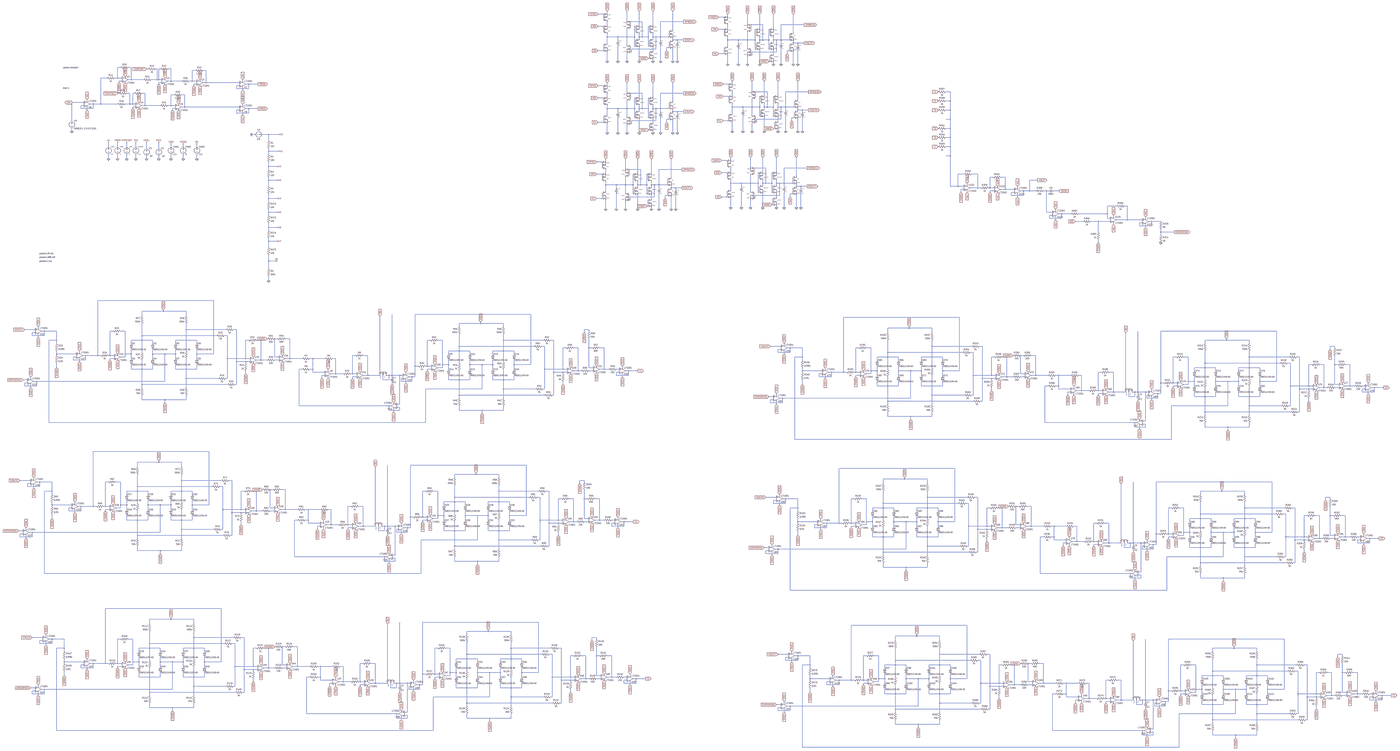
[diagram p0: schematic OZ_6_uniform_curves.asc, whole sheet]
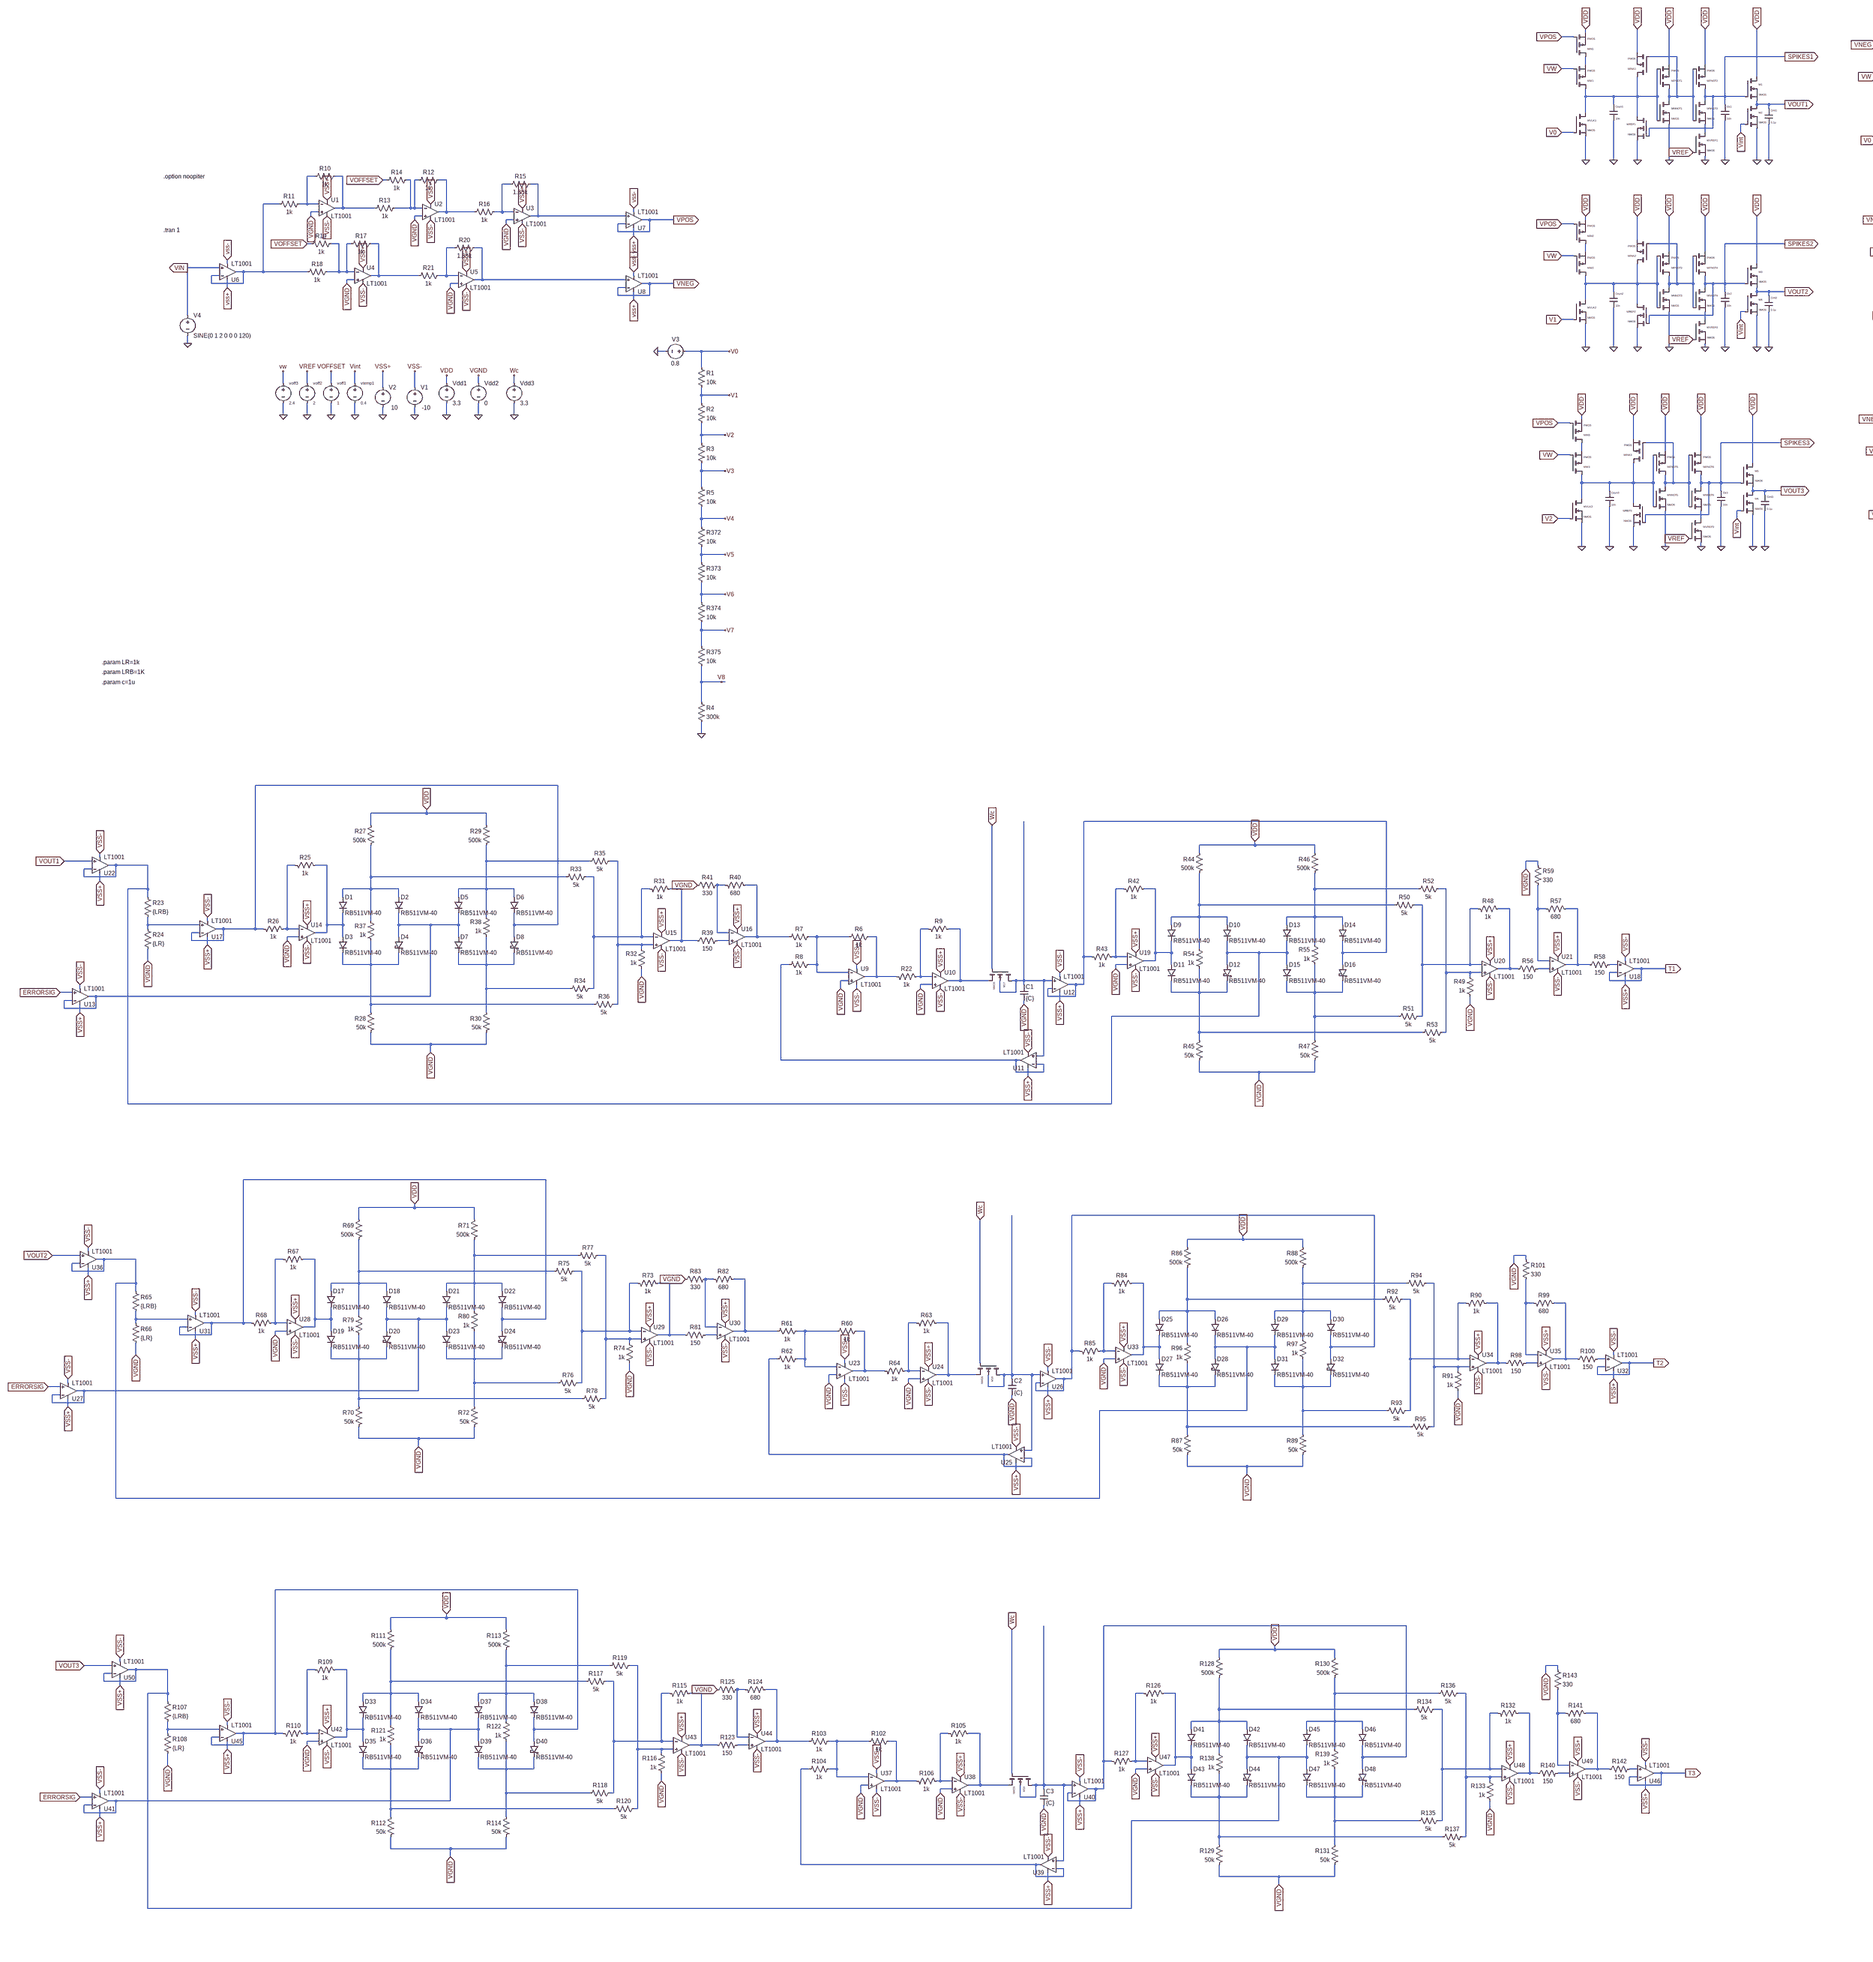
[diagram p1: schematic OZ_6_uniform_curves.asc, part, row 1 of 1, column 1 of 2]
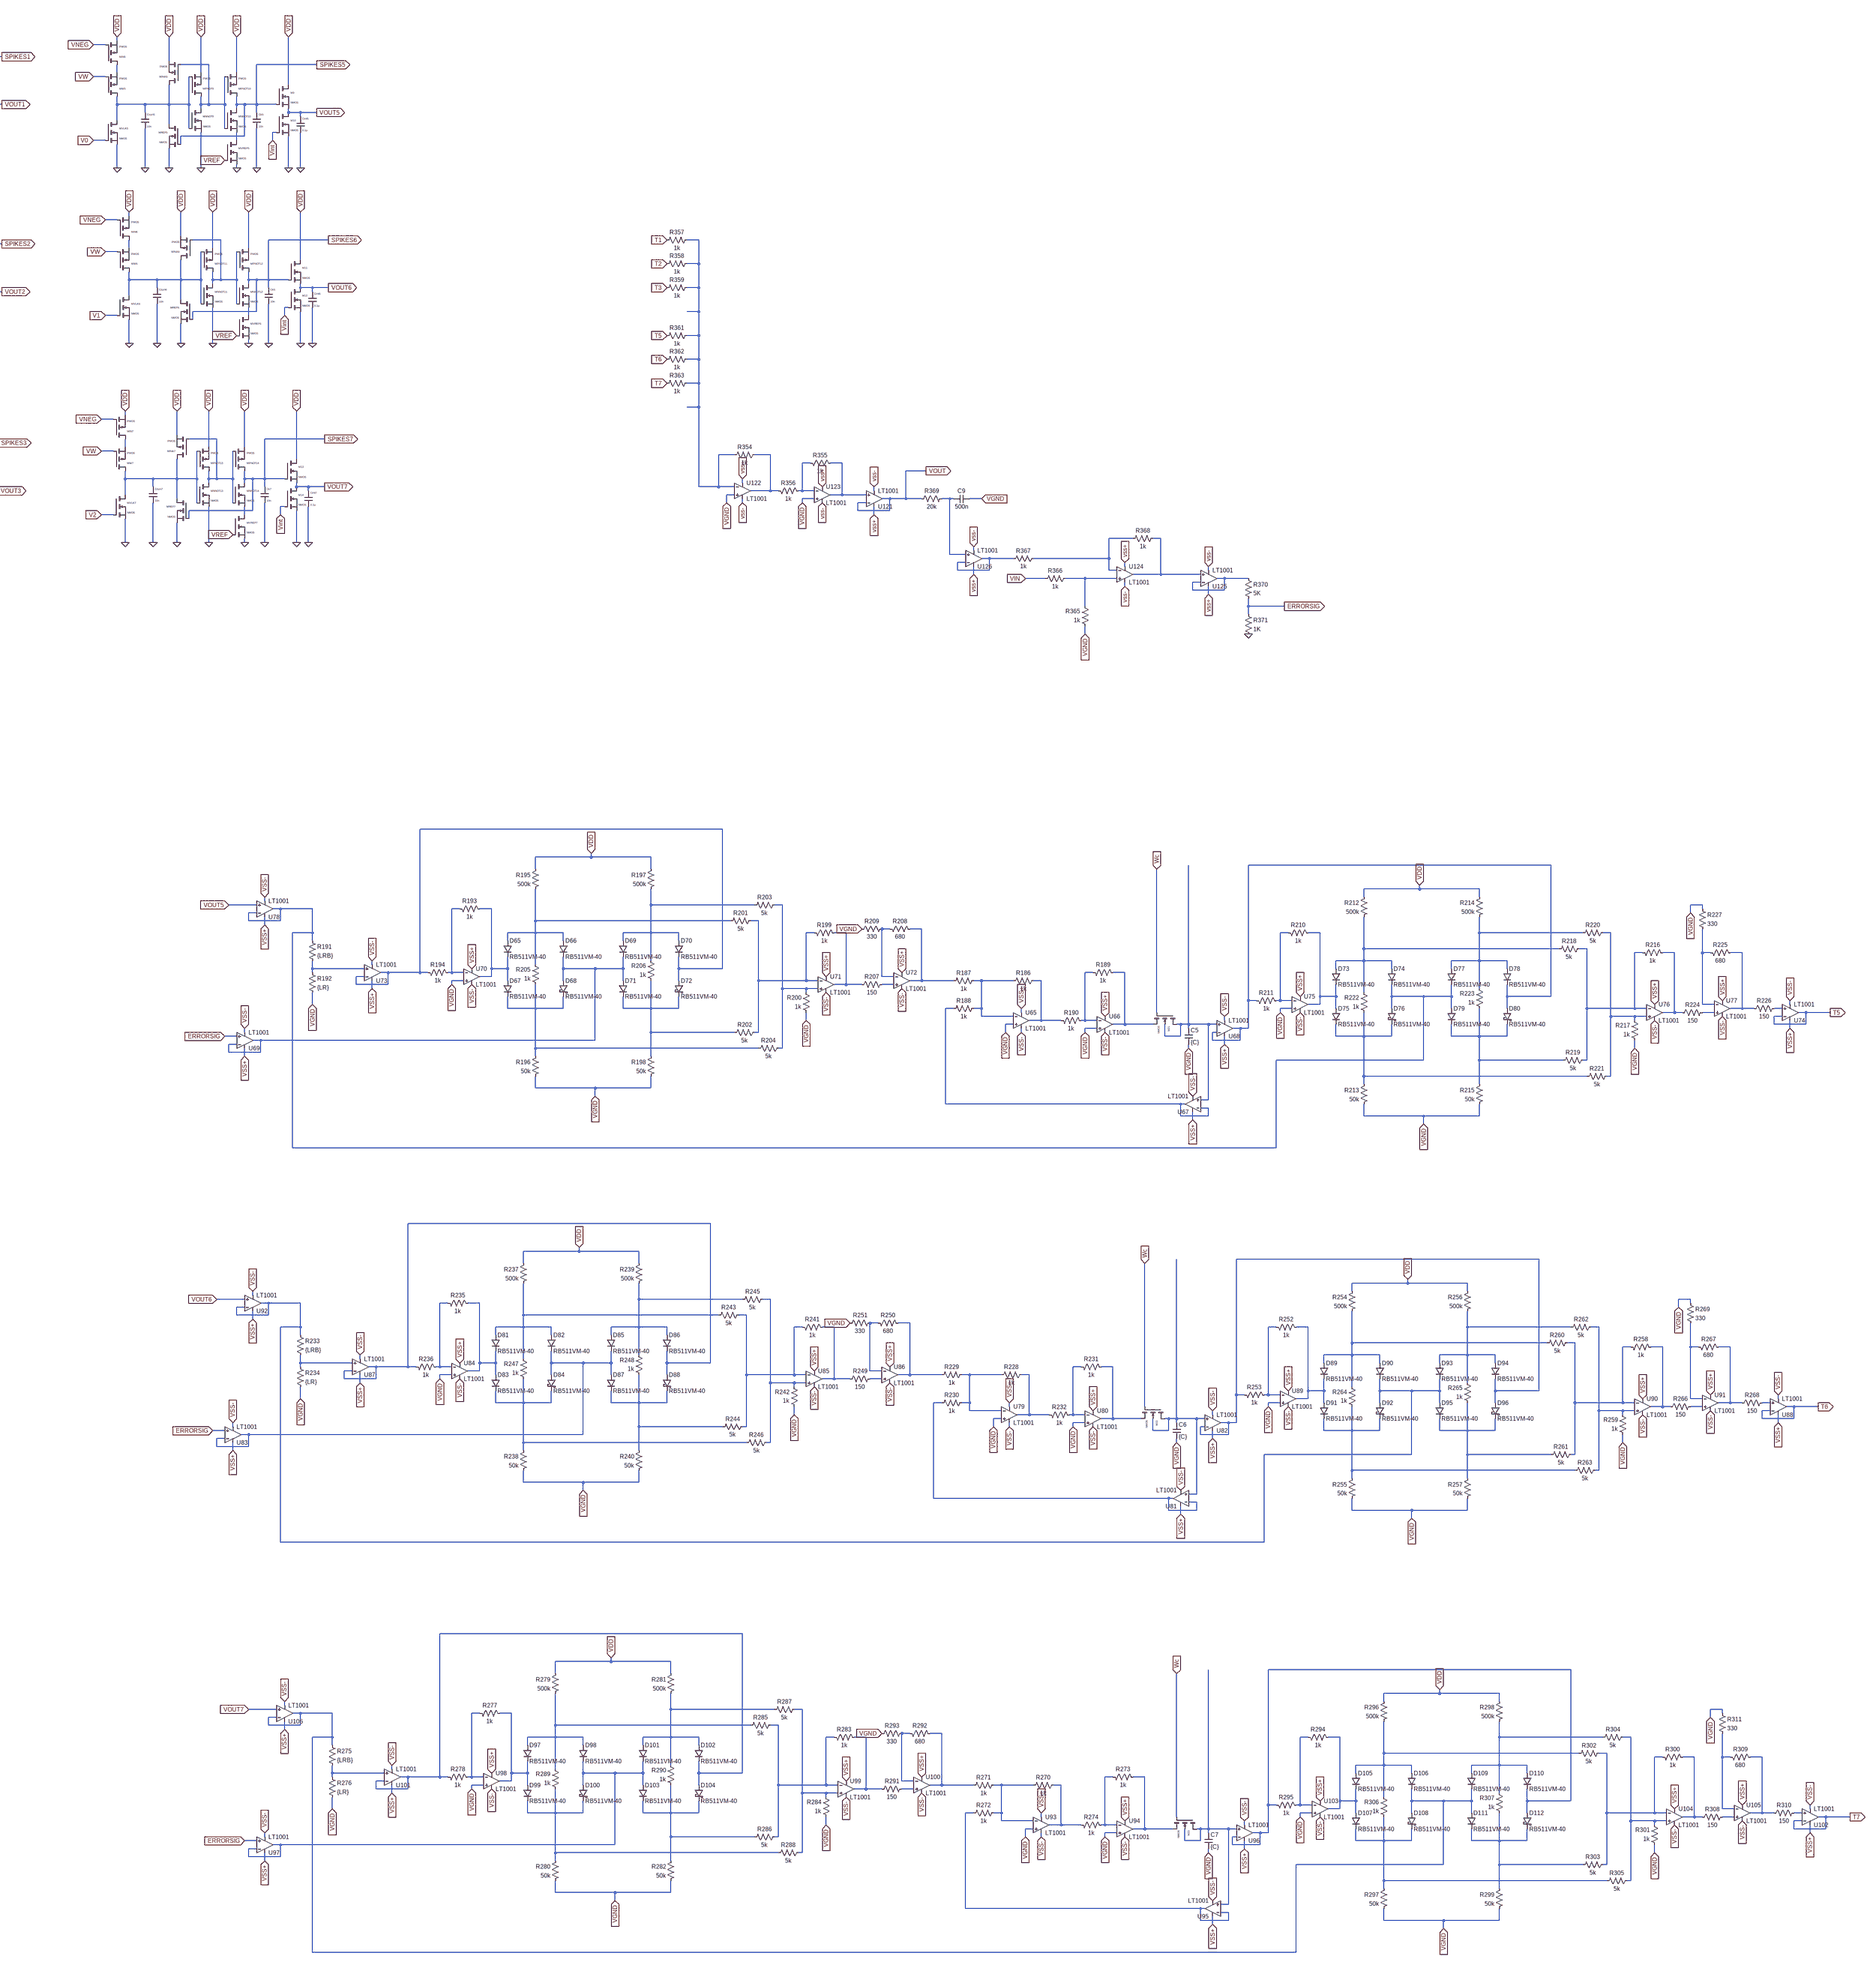
[diagram p2: schematic OZ_6_uniform_curves.asc, part, row 1 of 1, column 2 of 2]
* OZ_6_uniform_curves.asc
vtemp1 Vint 0 0.4
Vdd1 VDD 0 3.3
V1 VSS- 0 -10
V2 VSS+ 0 10
voff1 VOFFSET 0 1
voff2 VREF 0 2
voff3 vw 0 2.4
Vdd2 VGND 0 0
XU1 VGND N009 VSS+ VSS- N010 LT1001  ; pins In+ In- V+ V- OUT
R10 N010 N009 1k
R11 N009 N015 1k
XU2 VGND N011 VSS+ VSS- N012 LT1001  ; pins In+ In- V+ V- OUT
R12 N012 N011 1k
R13 N011 N010 1k
R14 N011 VOFFSET 1k
XU3 VGND N013 VSS+ VSS- N014 LT1001  ; pins In+ In- V+ V- OUT
R15 N014 N013 1.65k
R16 N013 N012 1k
XU4 VGND N018 VSS+ VSS- N019 LT1001  ; pins In+ In- V+ V- OUT
R17 N019 N018 1k
R18 N018 N015 1k
R19 N018 VOFFSET 1k
XU5 VGND N021 VSS+ VSS- N022 LT1001  ; pins In+ In- V+ V- OUT
R20 N022 N021 1.65k
R21 N021 N019 1k
XU6 VIN N015 VSS+ VSS- N015 LT1001  ; pins In+ In- V+ V- OUT
XU7 N014 VPOS VSS+ VSS- VPOS LT1001  ; pins In+ In- V+ V- OUT
XU8 N022 VNEG VSS+ VSS- VNEG LT1001  ; pins In+ In- V+ V- OUT
MW1 N005 vw N002 N002 PMOS
Csyn1 N005 0 10n V=4 Irms=162m Rser=0.395426 Lser=0 mfg="KEMET" pn="C0402C103K7PAC" type="X5R" IC=0
Ck1 SPIKES1 0 10n
MPNOT1 N001 N005 VDD VDD PMOS
MNNOT1 N001 N005 0 0 NMOS
MVREF1 N007 VREF 0 0 NMOS
MREF1 N005 SPIKES1 0 0 NMOS
MVLK1 N005 V0 0 0 NMOS
MINA1 N005 N001 VDD VDD PMOS
MIN1 N002 VPOS VDD VDD PMOS
MPNOT2 SPIKES1 N001 VDD VDD PMOS
MNNOT2 SPIKES1 N001 N007 N007 NMOS
M1 VDD SPIKES1 VOUT1 VOUT1 NMOS
M2 VOUT1 Vint 0 0 NMOS
Cint1 VOUT1 0 0.1µ
MW2 N026 vw N024 N024 PMOS
Csyn2 N026 0 10n V=4 Irms=162m Rser=0.395426 Lser=0 mfg="KEMET" pn="C0402C103K7PAC" type="X5R" IC=0
Ck2 SPIKES2 0 10n
MPNOT3 N020 N026 VDD VDD PMOS
MNNOT3 N020 N026 0 0 NMOS
MVREF2 N028 VREF 0 0 NMOS
MREF2 N026 SPIKES2 0 0 NMOS
MVLK2 N026 V1 0 0 NMOS
MINA2 N026 N020 VDD VDD PMOS
MIN2 N024 VPOS VDD VDD PMOS
MPNOT4 SPIKES2 N020 VDD VDD PMOS
MNNOT4 SPIKES2 N020 N028 N028 NMOS
M3 VDD SPIKES2 VOUT2 VOUT2 NMOS
M4 VOUT2 Vint 0 0 NMOS
Cint2 VOUT2 0 0.1µ
MW3 N037 vw N032 N032 PMOS
Csyn3 N037 0 10n V=4 Irms=162m Rser=0.395426 Lser=0 mfg="KEMET" pn="C0402C103K7PAC" type="X5R" IC=0
Ck3 SPIKES3 0 10n
MPNOT5 N030 N037 VDD VDD PMOS
MNNOT5 N030 N037 0 0 NMOS
MVREF3 N040 VREF 0 0 NMOS
MREF3 N037 SPIKES3 0 0 NMOS
MVLK3 N037 V2 0 0 NMOS
MINA3 N037 N030 VDD VDD PMOS
MIN3 N032 VPOS VDD VDD PMOS
MPNOT6 SPIKES3 N030 VDD VDD PMOS
MNNOT6 SPIKES3 N030 N040 N040 NMOS
M5 VDD SPIKES3 VOUT3 VOUT3 NMOS
M6 VOUT3 Vint 0 0 NMOS
Cint3 VOUT3 0 0.1µ
MW5 N006 vw N004 N004 PMOS
Csyn5 N006 0 10n V=4 Irms=162m Rser=0.395426 Lser=0 mfg="KEMET" pn="C0402C103K7PAC" type="X5R" IC=0
Ck5 SPIKES5 0 10n
MPNOT9 N003 N006 VDD VDD PMOS
MNNOT9 N003 N006 0 0 NMOS
MVREF5 N008 VREF 0 0 NMOS
MREF5 N006 SPIKES5 0 0 NMOS
MVLK5 N006 V0 0 0 NMOS
MINA5 N006 N003 VDD VDD PMOS
MIN5 N004 VNEG VDD VDD PMOS
MPNOT10 SPIKES5 N003 VDD VDD PMOS
MNNOT10 SPIKES5 N003 N008 N008 NMOS
M9 VDD SPIKES5 VOUT5 VOUT5 NMOS
M10 VOUT5 Vint 0 0 NMOS
Cint5 VOUT5 0 0.1µ
MW6 N025 vw N023 N023 PMOS
Csyn6 N025 0 10n V=4 Irms=162m Rser=0.395426 Lser=0 mfg="KEMET" pn="C0402C103K7PAC" type="X5R" IC=0
Ck6 SPIKES6 0 10n
MPNOT11 N016 N025 VDD VDD PMOS
MNNOT11 N016 N025 0 0 NMOS
MVREF6 N027 VREF 0 0 NMOS
MREF6 N025 SPIKES6 0 0 NMOS
MVLK6 N025 V1 0 0 NMOS
MINA6 N025 N016 VDD VDD PMOS
MIN6 N023 VNEG VDD VDD PMOS
MPNOT12 SPIKES6 N016 VDD VDD PMOS
MNNOT12 SPIKES6 N016 N027 N027 NMOS
M11 VDD SPIKES6 VOUT6 VOUT6 NMOS
M12 VOUT6 Vint 0 0 NMOS
Cint6 VOUT6 0 0.1µ
MW7 N036 vw N031 N031 PMOS
Csyn7 N036 0 10n V=4 Irms=162m Rser=0.395426 Lser=0 mfg="KEMET" pn="C0402C103K7PAC" type="X5R" IC=0
Ck7 SPIKES7 0 10n
MPNOT13 N029 N036 VDD VDD PMOS
MNNOT13 N029 N036 0 0 NMOS
MVREF7 N039 VREF 0 0 NMOS
MREF7 N036 SPIKES7 0 0 NMOS
MVLK7 N036 V2 0 0 NMOS
MINA7 N036 N029 VDD VDD PMOS
MIN7 N031 VNEG VDD VDD PMOS
MPNOT14 SPIKES7 N029 VDD VDD PMOS
MNNOT14 SPIKES7 N029 N039 N039 NMOS
M13 VDD SPIKES7 VOUT7 VOUT7 NMOS
M14 VOUT7 Vint 0 0 NMOS
Cint7 VOUT7 0 0.1µ
V4 VIN 0 SINE(0 1 2 0 0 0 120)
XU121 N035 VOUT VSS+ VSS- VOUT LT1001  ; pins In+ In- V+ V- OUT
XU122 VGND N017 VSS+ VSS- N033 LT1001  ; pins In+ In- V+ V- OUT
R354 N033 N017 1k
XU123 VGND N034 VSS+ VSS- N035 LT1001  ; pins In+ In- V+ V- OUT
R355 N034 N035 1k
R356 N033 N034 1k
R357 N017 T1 1k
R358 N017 T2 1k
R359 N017 T3 1k
R361 N017 T5 1k
R362 N017 T6 1k
R363 N017 T7 1k
M17 N104 Wc N079 N104 NMOS
C1 N104 VGND {C} IC=0
XU9 VGND N087 VSS+ VSS- N088 LT1001  ; pins In+ In- V+ V- OUT
R6 N088 N087 1k
R7 N087 N058 1k
R8 N087 N097 1k
XU10 VGND N078 VSS+ VSS- N079 LT1001  ; pins In+ In- V+ V- OUT
R9 N078 N079 1k
R22 N088 N078 1k
XU11 N104 N097 VSS+ VSS- N097 LT1001  ; pins In+ In- V+ V- OUT
XU12 N104 N047 VSS+ VSS- N047 LT1001  ; pins In+ In- V+ V- OUT
R23 N051 N076 {LRB}
R24 N076 VGND {LR}
XU13 ERRORSIG N077 VSS+ VSS- N077 LT1001  ; pins In+ In- V+ V- OUT
D1 N055 N053 RB511VM-40
XU14 VGND N052 VSS+ VSS- N053 LT1001  ; pins In+ In- V+ V- OUT
R25 N052 N053 1k
R26 N046 N052 1k
D2 N055 N077 RB511VM-40
D3 N053 N095 RB511VM-40
D4 N077 N095 RB511VM-40
R27 VDD N055 500k
R28 N095 VGND 50k
D5 N049 N077 RB511VM-40
D6 N049 N046 RB511VM-40
D7 N077 N096 RB511VM-40
D8 N046 N096 RB511VM-40
R29 VDD N049 500k
R30 N096 VGND 50k
XU15 N050 N056 VSS+ VSS- N059 LT1001  ; pins In+ In- V+ V- OUT
R31 N056 N059 1k
R32 VGND N050 1k
R33 N056 N055 5k
R34 N056 N096 5k
R35 N050 N049 5k
R36 N050 N095 5k
R37 N095 N055 1k
R38 N096 N049 1k
R39 N059 N089 150
XU16 N089 N057 VSS+ VSS- N058 LT1001  ; pins In+ In- V+ V- OUT
R40 N057 N058 680
R41 VGND N057 330
XU17 N076 N046 VSS+ VSS- N046 LT1001  ; pins In+ In- V+ V- OUT
XU18 N098 T1 VSS+ VSS- T1 LT1001  ; pins In+ In- V+ V- OUT
D9 N064 N061 RB511VM-40
XU19 VGND N060 VSS+ VSS- N061 LT1001  ; pins In+ In- V+ V- OUT
R42 N060 N061 1k
R43 N047 N060 1k
D10 N064 N051 RB511VM-40
D11 N061 N108 RB511VM-40
D12 N051 N108 RB511VM-40
R44 VDD N064 500k
R45 N108 VGND 50k
D13 N062 N051 RB511VM-40
D14 N062 N047 RB511VM-40
D15 N051 N109 RB511VM-40
D16 N047 N109 RB511VM-40
R46 VDD N062 500k
R47 N109 VGND 50k
XU20 N063 N065 VSS+ VSS- N068 LT1001  ; pins In+ In- V+ V- OUT
R48 N065 N068 1k
R49 VGND N063 1k
R50 N065 N064 5k
R51 N065 N109 5k
R52 N063 N062 5k
R53 N063 N108 5k
R54 N108 N064 1k
R55 N109 N062 1k
R56 N068 N099 150
XU21 N099 N069 VSS+ VSS- N070 LT1001  ; pins In+ In- V+ V- OUT
R57 N069 N070 680
R58 N070 N098 150
R59 VGND N069 330
XU22 VOUT1 N051 VSS+ VSS- N051 LT1001  ; pins In+ In- V+ V- OUT
M18 N176 Wc N151 N176 NMOS
C2 N176 VGND {C} IC=0
XU23 VGND N159 VSS+ VSS- N160 LT1001  ; pins In+ In- V+ V- OUT
R60 N160 N159 1k
R61 N159 N130 1k
R62 N159 N169 1k
XU24 VGND N150 VSS+ VSS- N151 LT1001  ; pins In+ In- V+ V- OUT
R63 N150 N151 1k
R64 N160 N150 1k
XU25 N176 N169 VSS+ VSS- N169 LT1001  ; pins In+ In- V+ V- OUT
XU26 N176 N119 VSS+ VSS- N119 LT1001  ; pins In+ In- V+ V- OUT
R65 N123 N148 {LRB}
R66 N148 VGND {LR}
XU27 ERRORSIG N149 VSS+ VSS- N149 LT1001  ; pins In+ In- V+ V- OUT
D17 N127 N125 RB511VM-40
XU28 VGND N124 VSS+ VSS- N125 LT1001  ; pins In+ In- V+ V- OUT
R67 N124 N125 1k
R68 N118 N124 1k
D18 N127 N149 RB511VM-40
D19 N125 N167 RB511VM-40
D20 N149 N167 RB511VM-40
R69 VDD N127 500k
R70 N167 VGND 50k
D21 N121 N149 RB511VM-40
D22 N121 N118 RB511VM-40
D23 N149 N168 RB511VM-40
D24 N118 N168 RB511VM-40
R71 VDD N121 500k
R72 N168 VGND 50k
XU29 N122 N128 VSS+ VSS- N131 LT1001  ; pins In+ In- V+ V- OUT
R73 N128 N131 1k
R74 VGND N122 1k
R75 N128 N127 5k
R76 N128 N168 5k
R77 N122 N121 5k
R78 N122 N167 5k
R79 N167 N127 1k
R80 N168 N121 1k
R81 N131 N161 150
XU30 N161 N129 VSS+ VSS- N130 LT1001  ; pins In+ In- V+ V- OUT
R82 N129 N130 680
R83 VGND N129 330
XU31 N148 N118 VSS+ VSS- N118 LT1001  ; pins In+ In- V+ V- OUT
XU32 N170 T2 VSS+ VSS- T2 LT1001  ; pins In+ In- V+ V- OUT
D25 N136 N133 RB511VM-40
XU33 VGND N132 VSS+ VSS- N133 LT1001  ; pins In+ In- V+ V- OUT
R84 N132 N133 1k
R85 N119 N132 1k
D26 N136 N123 RB511VM-40
D27 N133 N180 RB511VM-40
D28 N123 N180 RB511VM-40
R86 VDD N136 500k
R87 N180 VGND 50k
D29 N134 N123 RB511VM-40
D30 N134 N119 RB511VM-40
D31 N123 N181 RB511VM-40
D32 N119 N181 RB511VM-40
R88 VDD N134 500k
R89 N181 VGND 50k
XU34 N135 N137 VSS+ VSS- N140 LT1001  ; pins In+ In- V+ V- OUT
R90 N137 N140 1k
R91 VGND N135 1k
R92 N137 N136 5k
R93 N137 N181 5k
R94 N135 N134 5k
R95 N135 N180 5k
R96 N180 N136 1k
R97 N181 N134 1k
R98 N140 N171 150
XU35 N171 N141 VSS+ VSS- N142 LT1001  ; pins In+ In- V+ V- OUT
R99 N141 N142 680
R100 N142 N170 150
R101 VGND N141 330
XU36 VOUT2 N123 VSS+ VSS- N123 LT1001  ; pins In+ In- V+ V- OUT
M19 N248 Wc N223 N248 NMOS
C3 N248 VGND {C} IC=0
XU37 VGND N231 VSS+ VSS- N232 LT1001  ; pins In+ In- V+ V- OUT
R102 N232 N231 1k
R103 N231 N202 1k
R104 N231 N241 1k
XU38 VGND N222 VSS+ VSS- N223 LT1001  ; pins In+ In- V+ V- OUT
R105 N222 N223 1k
R106 N232 N222 1k
XU39 N248 N241 VSS+ VSS- N241 LT1001  ; pins In+ In- V+ V- OUT
XU40 N248 N191 VSS+ VSS- N191 LT1001  ; pins In+ In- V+ V- OUT
R107 N195 N220 {LRB}
R108 N220 VGND {LR}
XU41 ERRORSIG N221 VSS+ VSS- N221 LT1001  ; pins In+ In- V+ V- OUT
D33 N199 N197 RB511VM-40
XU42 VGND N196 VSS+ VSS- N197 LT1001  ; pins In+ In- V+ V- OUT
R109 N196 N197 1k
R110 N190 N196 1k
D34 N199 N221 RB511VM-40
D35 N197 N239 RB511VM-40
D36 N221 N239 RB511VM-40
R111 VDD N199 500k
R112 N239 VGND 50k
D37 N193 N221 RB511VM-40
D38 N193 N190 RB511VM-40
D39 N221 N240 RB511VM-40
D40 N190 N240 RB511VM-40
R113 VDD N193 500k
R114 N240 VGND 50k
XU43 N194 N200 VSS+ VSS- N203 LT1001  ; pins In+ In- V+ V- OUT
R115 N200 N203 1k
R116 VGND N194 1k
R117 N200 N199 5k
R118 N200 N240 5k
R119 N194 N193 5k
R120 N194 N239 5k
R121 N239 N199 1k
R122 N240 N193 1k
R123 N203 N233 150
XU44 N233 N201 VSS+ VSS- N202 LT1001  ; pins In+ In- V+ V- OUT
R124 N201 N202 680
R125 VGND N201 330
XU45 N220 N190 VSS+ VSS- N190 LT1001  ; pins In+ In- V+ V- OUT
XU46 N242 T3 VSS+ VSS- T3 LT1001  ; pins In+ In- V+ V- OUT
D41 N208 N205 RB511VM-40
XU47 VGND N204 VSS+ VSS- N205 LT1001  ; pins In+ In- V+ V- OUT
R126 N204 N205 1k
R127 N191 N204 1k
D42 N208 N195 RB511VM-40
D43 N205 N252 RB511VM-40
D44 N195 N252 RB511VM-40
R128 VDD N208 500k
R129 N252 VGND 50k
D45 N206 N195 RB511VM-40
D46 N206 N191 RB511VM-40
D47 N195 N253 RB511VM-40
D48 N191 N253 RB511VM-40
R130 VDD N206 500k
R131 N253 VGND 50k
XU48 N207 N209 VSS+ VSS- N212 LT1001  ; pins In+ In- V+ V- OUT
R132 N209 N212 1k
R133 VGND N207 1k
R134 N209 N208 5k
R135 N209 N253 5k
R136 N207 N206 5k
R137 N207 N252 5k
R138 N252 N208 1k
R139 N253 N206 1k
R140 N212 N243 150
XU49 N243 N213 VSS+ VSS- N214 LT1001  ; pins In+ In- V+ V- OUT
R141 N213 N214 680
R142 N214 N242 150
R143 VGND N213 330
XU50 VOUT3 N195 VSS+ VSS- N195 LT1001  ; pins In+ In- V+ V- OUT
M21 N115 Wc N103 N115 NMOS
C5 N115 VGND {C} IC=0
XU65 VGND N105 VSS+ VSS- N106 LT1001  ; pins In+ In- V+ V- OUT
R186 N106 N105 1k
R187 N105 N081 1k
R188 N105 N112 1k
XU66 VGND N102 VSS+ VSS- N103 LT1001  ; pins In+ In- V+ V- OUT
R189 N102 N103 1k
R190 N106 N102 1k
XU67 N115 N112 VSS+ VSS- N112 LT1001  ; pins In+ In- V+ V- OUT
XU68 N115 N054 VSS+ VSS- N054 LT1001  ; pins In+ In- V+ V- OUT
R191 N071 N100 {LRB}
R192 N100 VGND {LR}
XU69 ERRORSIG N101 VSS+ VSS- N101 LT1001  ; pins In+ In- V+ V- OUT
D65 N074 N073 RB511VM-40
XU70 VGND N072 VSS+ VSS- N073 LT1001  ; pins In+ In- V+ V- OUT
R193 N072 N073 1k
R194 N048 N072 1k
D66 N074 N101 RB511VM-40
D67 N073 N110 RB511VM-40
D68 N101 N110 RB511VM-40
R195 VDD N074 500k
R196 N110 VGND 50k
D69 N066 N101 RB511VM-40
D70 N066 N048 RB511VM-40
D71 N101 N111 RB511VM-40
D72 N048 N111 RB511VM-40
R197 VDD N066 500k
R198 N111 VGND 50k
XU71 N067 N075 VSS+ VSS- N082 LT1001  ; pins In+ In- V+ V- OUT
R199 N075 N082 1k
R200 VGND N067 1k
R201 N075 N074 5k
R202 N075 N111 5k
R203 N067 N066 5k
R204 N067 N110 5k
R205 N110 N074 1k
R206 N111 N066 1k
R207 N082 N107 150
XU72 N107 N080 VSS+ VSS- N081 LT1001  ; pins In+ In- V+ V- OUT
R208 N080 N081 680
R209 VGND N080 330
XU73 N100 N048 VSS+ VSS- N048 LT1001  ; pins In+ In- V+ V- OUT
XU74 N113 T5 VSS+ VSS- T5 LT1001  ; pins In+ In- V+ V- OUT
D73 N090 N084 RB511VM-40
XU75 VGND N083 VSS+ VSS- N084 LT1001  ; pins In+ In- V+ V- OUT
R210 N083 N084 1k
R211 N054 N083 1k
D74 N090 N071 RB511VM-40
D75 N084 N116 RB511VM-40
D76 N071 N116 RB511VM-40
R212 VDD N090 500k
R213 N116 VGND 50k
D77 N085 N071 RB511VM-40
D78 N085 N054 RB511VM-40
D79 N071 N117 RB511VM-40
D80 N054 N117 RB511VM-40
R214 VDD N085 500k
R215 N117 VGND 50k
XU76 N086 N091 VSS+ VSS- N092 LT1001  ; pins In+ In- V+ V- OUT
R216 N091 N092 1k
R217 VGND N086 1k
R218 N091 N090 5k
R219 N091 N117 5k
R220 N086 N085 5k
R221 N086 N116 5k
R222 N116 N090 1k
R223 N117 N085 1k
R224 N092 N114 150
XU77 N114 N093 VSS+ VSS- N094 LT1001  ; pins In+ In- V+ V- OUT
R225 N093 N094 680
R226 N094 N113 150
R227 VGND N093 330
XU78 VOUT5 N071 VSS+ VSS- N071 LT1001  ; pins In+ In- V+ V- OUT
M22 N187 Wc N175 N187 NMOS
C6 N187 VGND {C} IC=0
XU79 VGND N177 VSS+ VSS- N178 LT1001  ; pins In+ In- V+ V- OUT
R228 N178 N177 1k
R229 N177 N153 1k
R230 N177 N184 1k
XU80 VGND N174 VSS+ VSS- N175 LT1001  ; pins In+ In- V+ V- OUT
R231 N174 N175 1k
R232 N178 N174 1k
XU81 N187 N184 VSS+ VSS- N184 LT1001  ; pins In+ In- V+ V- OUT
XU82 N187 N126 VSS+ VSS- N126 LT1001  ; pins In+ In- V+ V- OUT
R233 N143 N172 {LRB}
R234 N172 VGND {LR}
XU83 ERRORSIG N173 VSS+ VSS- N173 LT1001  ; pins In+ In- V+ V- OUT
D81 N146 N145 RB511VM-40
XU84 VGND N144 VSS+ VSS- N145 LT1001  ; pins In+ In- V+ V- OUT
R235 N144 N145 1k
R236 N120 N144 1k
D82 N146 N173 RB511VM-40
D83 N145 N182 RB511VM-40
D84 N173 N182 RB511VM-40
R237 VDD N146 500k
R238 N182 VGND 50k
D85 N138 N173 RB511VM-40
D86 N138 N120 RB511VM-40
D87 N173 N183 RB511VM-40
D88 N120 N183 RB511VM-40
R239 VDD N138 500k
R240 N183 VGND 50k
XU85 N139 N147 VSS+ VSS- N154 LT1001  ; pins In+ In- V+ V- OUT
R241 N147 N154 1k
R242 VGND N139 1k
R243 N147 N146 5k
R244 N147 N183 5k
R245 N139 N138 5k
R246 N139 N182 5k
R247 N182 N146 1k
R248 N183 N138 1k
R249 N154 N179 150
XU86 N179 N152 VSS+ VSS- N153 LT1001  ; pins In+ In- V+ V- OUT
R250 N152 N153 680
R251 VGND N152 330
XU87 N172 N120 VSS+ VSS- N120 LT1001  ; pins In+ In- V+ V- OUT
XU88 N185 T6 VSS+ VSS- T6 LT1001  ; pins In+ In- V+ V- OUT
D89 N162 N156 RB511VM-40
XU89 VGND N155 VSS+ VSS- N156 LT1001  ; pins In+ In- V+ V- OUT
R252 N155 N156 1k
R253 N126 N155 1k
D90 N162 N143 RB511VM-40
D91 N156 N188 RB511VM-40
D92 N143 N188 RB511VM-40
R254 VDD N162 500k
R255 N188 VGND 50k
D93 N157 N143 RB511VM-40
D94 N157 N126 RB511VM-40
D95 N143 N189 RB511VM-40
D96 N126 N189 RB511VM-40
R256 VDD N157 500k
R257 N189 VGND 50k
XU90 N158 N163 VSS+ VSS- N164 LT1001  ; pins In+ In- V+ V- OUT
R258 N163 N164 1k
R259 VGND N158 1k
R260 N163 N162 5k
R261 N163 N189 5k
R262 N158 N157 5k
R263 N158 N188 5k
R264 N188 N162 1k
R265 N189 N157 1k
R266 N164 N186 150
XU91 N186 N165 VSS+ VSS- N166 LT1001  ; pins In+ In- V+ V- OUT
R267 N165 N166 680
R268 N166 N185 150
R269 VGND N165 330
XU92 VOUT6 N143 VSS+ VSS- N143 LT1001  ; pins In+ In- V+ V- OUT
M23 N259 Wc N247 N259 NMOS
C7 N259 VGND {C} IC=0
XU93 VGND N249 VSS+ VSS- N250 LT1001  ; pins In+ In- V+ V- OUT
R270 N250 N249 1k
R271 N249 N225 1k
R272 N249 N256 1k
XU94 VGND N246 VSS+ VSS- N247 LT1001  ; pins In+ In- V+ V- OUT
R273 N246 N247 1k
R274 N250 N246 1k
XU95 N259 N256 VSS+ VSS- N256 LT1001  ; pins In+ In- V+ V- OUT
XU96 N259 N198 VSS+ VSS- N198 LT1001  ; pins In+ In- V+ V- OUT
R275 N215 N244 {LRB}
R276 N244 VGND {LR}
XU97 ERRORSIG N245 VSS+ VSS- N245 LT1001  ; pins In+ In- V+ V- OUT
D97 N218 N217 RB511VM-40
XU98 VGND N216 VSS+ VSS- N217 LT1001  ; pins In+ In- V+ V- OUT
R277 N216 N217 1k
R278 N192 N216 1k
D98 N218 N245 RB511VM-40
D99 N217 N254 RB511VM-40
D100 N245 N254 RB511VM-40
R279 VDD N218 500k
R280 N254 VGND 50k
D101 N210 N245 RB511VM-40
D102 N210 N192 RB511VM-40
D103 N245 N255 RB511VM-40
D104 N192 N255 RB511VM-40
R281 VDD N210 500k
R282 N255 VGND 50k
XU99 N211 N219 VSS+ VSS- N226 LT1001  ; pins In+ In- V+ V- OUT
R283 N219 N226 1k
R284 VGND N211 1k
R285 N219 N218 5k
R286 N219 N255 5k
R287 N211 N210 5k
R288 N211 N254 5k
R289 N254 N218 1k
R290 N255 N210 1k
R291 N226 N251 150
XU100 N251 N224 VSS+ VSS- N225 LT1001  ; pins In+ In- V+ V- OUT
R292 N224 N225 680
R293 VGND N224 330
XU101 N244 N192 VSS+ VSS- N192 LT1001  ; pins In+ In- V+ V- OUT
XU102 N257 T7 VSS+ VSS- T7 LT1001  ; pins In+ In- V+ V- OUT
D105 N234 N228 RB511VM-40
XU103 VGND N227 VSS+ VSS- N228 LT1001  ; pins In+ In- V+ V- OUT
R294 N227 N228 1k
R295 N198 N227 1k
D106 N234 N215 RB511VM-40
D107 N228 N260 RB511VM-40
D108 N215 N260 RB511VM-40
R296 VDD N234 500k
R297 N260 VGND 50k
D109 N229 N215 RB511VM-40
D110 N229 N198 RB511VM-40
D111 N215 N261 RB511VM-40
D112 N198 N261 RB511VM-40
R298 VDD N229 500k
R299 N261 VGND 50k
XU104 N230 N235 VSS+ VSS- N236 LT1001  ; pins In+ In- V+ V- OUT
R300 N235 N236 1k
R301 VGND N230 1k
R302 N235 N234 5k
R303 N235 N261 5k
R304 N230 N229 5k
R305 N230 N260 5k
R306 N260 N234 1k
R307 N261 N229 1k
R308 N236 N258 150
XU105 N258 N237 VSS+ VSS- N238 LT1001  ; pins In+ In- V+ V- OUT
R309 N237 N238 680
R310 N238 N257 150
R311 VGND N237 330
XU106 VOUT7 N215 VSS+ VSS- N215 LT1001  ; pins In+ In- V+ V- OUT
XU124 N044 N041 VSS+ VSS- N042 LT1001  ; pins In+ In- V+ V- OUT
R365 VGND N044 1k
R366 N044 VIN 1k
R367 N041 N043 1k
R368 N042 N041 1k
XU125 N042 N045 VSS+ VSS- N045 LT1001  ; pins In+ In- V+ V- OUT
R369 VOUT N038 20k
C9 N038 VGND 500n
XU126 N038 N043 VSS+ VSS- N043 LT1001  ; pins In+ In- V+ V- OUT
R370 N045 ERRORSIG 5K
R371 ERRORSIG 0 1K
Vdd3 Wc 0 3.3
V3 V0 0 0.8
R1 V0 V1 10k
R2 V1 V2 10k
R3 V2 V3 10k
R4 V8 0 300k
R5 V3 V4 10k
R372 V4 V5 10k
R373 V5 V6 10k
R374 V6 V7 10k
R375 V7 V8 10k
.model D D
.lib standard.dio
.model NMOS NMOS
.model PMOS PMOS
.lib standard.mos
.tran 1
.option noopiter
.param LR=1k
.param LRB=1K
.param c=1u
.lib LTC.lib
.backanno
.end